# Altium project ArduinoNano.PrjPcb
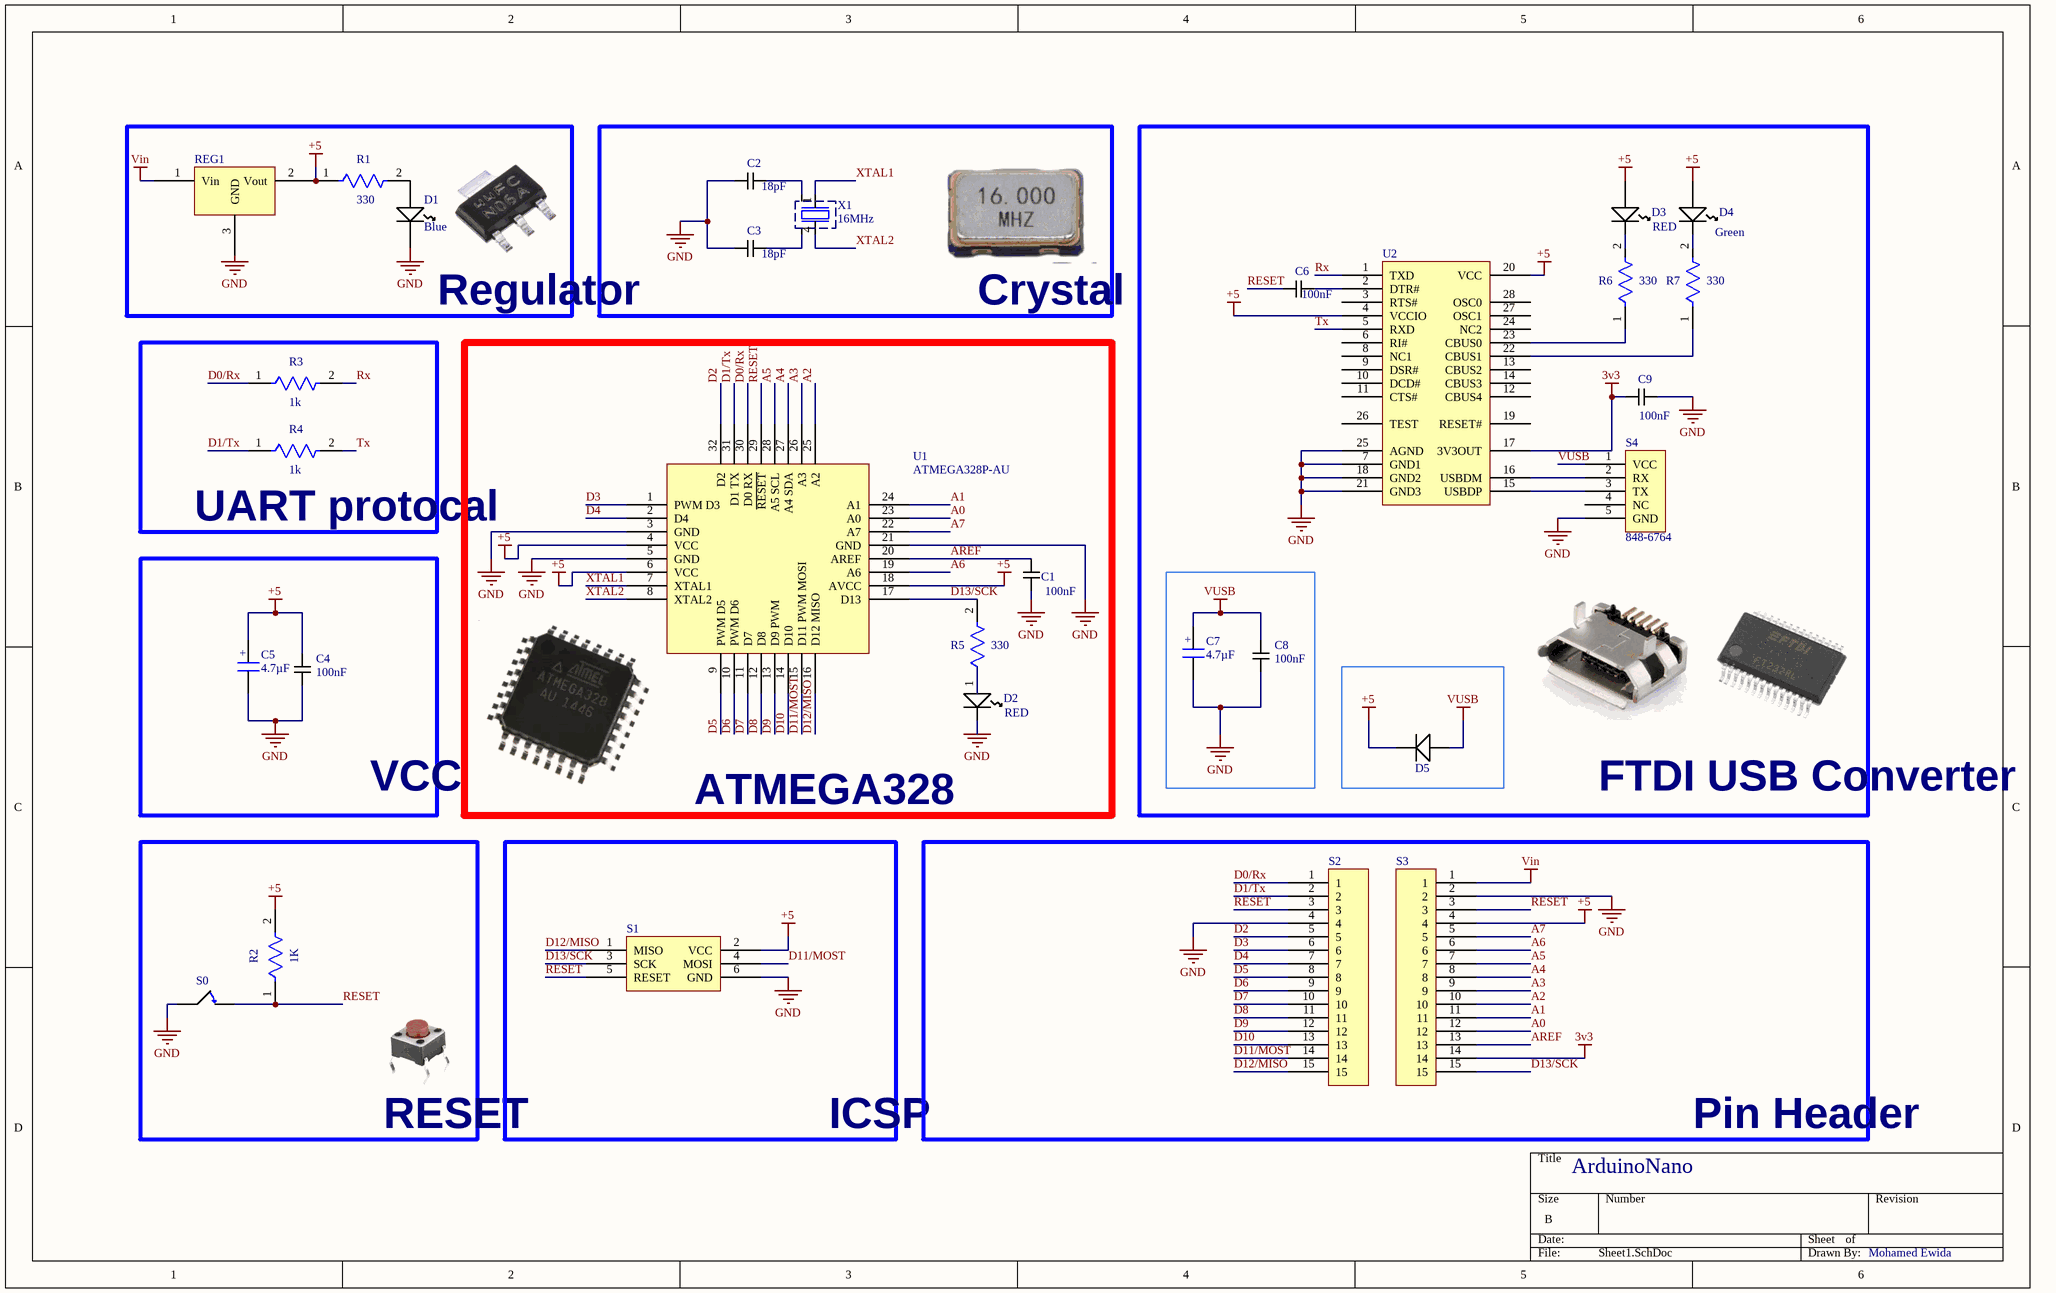
[diagram p0: Sheet1.SchDoc]
1 sheet, 30 parts. Net scope: global (net labels, ports and power ports of the same name join across sheets).
Board file: PCB1.PcbDoc

## Sheet Sheet1.SchDoc
size B; SheetNumber: 1; SheetTotal: 1

### Parts
C1  Capacitance: 100nF  [CAPCP2012X09N]  (hidden comment: 100nF Ceramic Multilayer Capacitor_1)
C2  Capacitance: 18pF  [CAPCP2012X09N]  (hidden comment: C0805C180J5GACTU)
C3  Capacitance: 18pF  [CAPCP2012X09N]  (hidden comment: C0805C180J5GACTU)
C4  Capacitance: 100nF  [CAPCP2012X09N]  (hidden comment: 100nF Ceramic Multilayer Capacitor_1)
C5  value 4.7µF  [CASE A - 3216X18]  (hidden comment: Capacitor SMT Tantalum)
C6  Capacitance: 100nF  [CAPCP2012X09N]  (hidden comment: 100nF Ceramic Multilayer Capacitor_1)
C7  value 4.7µF  [CASE A - 3216X18]  (hidden comment: Capacitor SMT Tantalum)
C8  Capacitance: 100nF  [CAPCP2012X09N]  (hidden comment: 100nF Ceramic Multilayer Capacitor_1)
C9  Capacitance: 100nF  [CAPCP2012X09N]  (hidden comment: 100nF Ceramic Multilayer Capacitor_1)
D1  Kingbright Blue LED, 60 mcd 120 ° 0805  [LED1913X12NBLUE]  (value not drawn)
D2  Color: RED  [LED1913X12NRED]  (hidden comment: Kingbright Red LED, 100 mcd 120 ° 0805)
D3  Color: RED  [LED1913X12NRED]  (hidden comment: Kingbright Red LED, 100 mcd 120 ° 0805)
D4  Color: Green  [LED1913X12NGREEN]  (hidden comment: Kingbright Green LED, 70 mcd 120 ° 0805)
D5  Panasonic DB2J20900L Schottky Diode, 0.5A, 20V, 2.4ns, 2-Pin SMini2 F5 B  [DIOM1712X07N]  (value not drawn)
R1  ERA-3AEB102V  [FP-ERA3A-IPC_C]  (value not drawn)
R2  ERA-3AEB102V  [FP-ERA3A-IPC_C]  (value not drawn)
R3  Resistance: 1k  [FP-ERA3A-IPC_C]  (hidden comment: ERA-3AEB102V)
R4  Resistance: 1k  [FP-ERA3A-IPC_C]  (hidden comment: ERA-3AEB102V)
R5  Resistance: 330  [FP-ERA3A-IPC_C]  (hidden comment: ERA-3AEB102V)
R6  Resistance: 330  [FP-ERA3A-IPC_C]  (hidden comment: ERA-3AEB102V)
R7  Resistance: 330  [FP-ERA3A-IPC_C]  (hidden comment: ERA-3AEB102V)
REG1  LM1117MP-5.0/NOPB, Low Dropout Voltage Regulator, 1.5A, 5 V ±1%, 4-Pin SOT-223  [SOT230P700X180-4N]  (value not drawn)
S0  Tactile Switch SPST- NO 0.05A @24V  [Tactile Switch]  (value not drawn)
S1  Programming Headers Dual Row  [ISP HEADER]  (value not drawn)
S2  connector;str header;single row;.1 cont centers;.095 tail;gold or gtx;36 contact  [Header]  (value not drawn)
S3  connector;str header;single row;.1 cont centers;.095 tail;gold or gtx;36 contact  [Header]  (value not drawn)
S4  RS Stock No: 848-6764  [MicroUSB]  (hidden comment: NewMolex Right Angle SMT Female Type B Micro USB Connector, 30 V ac, 1.8A)
U1  ATMEGA328P-AU  [TQFP80P900X900X120-32N]
U2  FT232RL, Universal Asynchronous Receiver & Transmitter 3MBd, 28-Pin, SSOP  [SOP65P780X200-28N]  (value not drawn)
X1  value 16MHz  [Aker S5C Crystal]  (hidden comment: Aker 16MHz Crystal SMT)

### Blocks framed on the sheet
Regulator: D1 R1 REG1
Crystal: C2 C3 X1
FTDI USB Converter: C6-C9 D3-D5 R6 R7 S4 U2
UART protocal: R3 R4
ATMEGA328: C1 D2 R5 U1
VCC: C4 C5
RESET: R2 S0
ICSP: S1
Pin Header: S2 S3

### Nets
3v3: C9.1 S3.14 U2.17(3V3OUT)
+5: C4.2 C5.1 D3.1(A) D4.1(A) D5.1 R1.1 R2.2 REG1.2(Vout) S1.2(VCC) S3.4 U1.4(VCC) U1.6(VCC) U1.18(AVCC) U2.4(VCCIO) U2.20(VCC)
GND: C1.1 C2.1 C3.1 C4.1 C5.2 C7.2 C8.1 C9.2 D1.2(K) D2.2(K) S0.1 S1.6(GND) S2.4 S3.2 S4.5(GND) U1.3(GND) U1.5(GND) U1.21(GND) U2.7(GND1) U2.18(GND2) U2.21(GND3) U2.25(AGND)
Vin: REG1.1(Vin) S3.1
VUSB: C7.1 C8.2 D5.2 S4.1(VCC)
A0: S3.12 U1.23(A0)
A1: S3.11 U1.24(A1)
A2: S3.10 U1.25(A2)
A3: S3.9 U1.26(A3)
A4: S3.8 U1.27(A4_SDA)
A5: S3.7 U1.28(A5_SCL)
A6: S3.6 U1.19(A6)
A7: S3.5 U1.22(A7)
AREF: C1.2 S3.13 U1.20(AREF)
D0/Rx: R3.1 S2.1 U1.30(D0_RX)
D1/Tx: R4.1 S2.2 U1.31(D1_TX)
D2: S2.5 U1.32(D2)
D3: S2.6 U1.1(PWM_D3)
D4: S2.7 U1.2(D4)
D5: S2.8 U1.9(PWM_D5)
D6: S2.9 U1.10(PWM_D6)
D7: S2.10 U1.11(D7)
D8: S2.11 U1.12(D8)
D9: S2.12 U1.13(D9_PWM)
D10: S2.13 U1.14(D10)
D11/MOST: S1.4(MOSI) S2.14 U1.15(D11_PWM_MOSI)
D12/MISO: S1.1(MISO) S2.15 U1.16(D12_MISO)
D13/SCK: R5.2 S1.3(SCK) S3.15 U1.17(D13)
RESET: C6.1 R2.1 S0.1 S1.5(RESET) S2.3 S3.3 U1.29(~{RESET})
Rx: R3.2 U2.1(TXD)
Tx: R4.2 U2.5(RXD)
XTAL1: U1.7(XTAL1) X1.1
XTAL2: U1.8(XTAL2) X1.4
NetC2_2: C2.2 X1.3(Gnd)
NetC3_2: C3.2 X1.2(Gnd)
NetC6_2: C6.2 U2.2(DTR#)
NetD1_1: D1.1(A) R1.2
NetD2_1: D2.1(A) R5.1
NetD3_2: D3.2(K) R6.2
NetD4_2: D4.2(K) R7.2
NetR6_1: R6.1 U2.23(CBUS0)
NetR7_1: R7.1 U2.22(CBUS1)
NetS4_2: S4.2(RX) U2.16(USBDM)
NetS4_3: S4.3(TX) U2.15(USBDP)

Not connected (* = marked no-connect by the designer): REG1 3(GND); S4 4(NC); U2 3(RTS#) 6(RI#) 8(NC1) 9(DSR#) 10(DCD#) 11(CTS#) 12(CBUS4) 13(CBUS2) 14(CBUS3) 19(RESET#) 24(NC2) 26(TEST) 27(OSC1) 28(OSC0)

### Notes on the sheet
- (near R1) 330
- (near D1) Blue
- (near R2) 1K
- ArduinoNano
- Mohamed Ewida
- Labels drawn without touching a wire or pin: GND
- (in symbol 4.7µF Tant RS 496-3545) +

### Library data of the parts
C1 C4 C6 C8 C9 = 100nF Ceramic Multilayer Capacitor_1: AVX 0805 Standard 100nF Ceramic Multilayer Capacitor, 50 V dc X7R Dielectric ±10% SMD; Voltage: 50V; Creator: Ritesh Kanjee; Date Created: 18 February 2015; Package: 0805; Manufacturer: AVX; RS Stock No.: 464-6688; Datasheet URL: http://za.rs-online.com/web/p/ceramic-multilayer-capacitors/4646688/
C2 C3 = 18pF Ceramic Multilayer Capacitor, 50 V dc C0G Dielectric ±5% SMD: Manufacturer: Kemet; Voltage: 50V; Creator: Ritesh Kanjee; Date Created: 18 February 2015; Package: 0805; RS Stock No.: 648-0935; Datasheet URL: http://za.rs-online.com/web/p/ceramic-multilayer-capacitors/6480935/?searchTerm=C0805C180J5GACTU&relevancy-data=636F3D3226696E3D4931384E4B6E6F776E41734D504E266C753D656E266D6D3D6D61746368616C6C7061727469616C26706D3D5E5B5C707B4C7D5C707B4E647D2D2C2F255C2E5D2B2426706F3D313326736E3D592673743D4D414E5F504152545F4E554D4245522677633D424F5448267573743D4330383035433138304A35474143545526
C5 C7 = 4.7µF Tant RS 496-3545: Capacitor,tantalum,SMT,16V,4.7uF,10%,A-case; Part Originator: H Theron; RS Stock Nr.: 496-3545; Tolerance: 10%; Package: 3216-18; Publisher: DPSS; LatestRevisionDate: 28-April-2010; ComponentLink1Description: Supplier Website; ComponentLink1URL: http://za.rs-online.com/web/search/searchBrowseAction.html?method=getProduct&R=4963545; ComponentLink2Description: RS Data sheet; ComponentLink2URL: http://docs-europe.origin.electrocomponents.com/webdocs/04ed/0900766b804ed4cc.pdf; Voltage: 16V
D1 = Kingbright Blue LED, 60 mcd 120 ° 0805: Manufacturer Part No.: KP-2012PBC-A; Forward Voltage: 3.2V; Creator: Ritesh Kanjee; Date Created: 18 February 2015; Manufacturer: KingBright; RS Stock No.: 466-3784; Datasheet URL: http://za.rs-online.com/web/p/visible-leds/4663784/; Color: Blue
D2 D3 = Kingbright Red LED, 100 mcd 120 ° 0805: Manufacturer Part No.: KP-2012SRC-PRV; Forward Voltage: 1.85V; Creator: Ritesh Kanjee; Date Created: 18 February 2015; Manufacturer: KingBright; RS Stock No.: 466-3813; Datasheet URL: http://za.rs-online.com/web/p/visible-leds/4663813/
D4 = Kingbright Green LED, 70 mcd 120 ° 0805: Manufacturer Part No.: KP-2012MGC; Forward Voltage: 2.1 V; Creator: Ritesh Kanjee; Date Created: 18 February 2015; Manufacturer: KingBright; RS Stock No.: 466-3778; Datasheet URL: http://za.rs-online.com/web/p/visible-leds/4663778/
D5 = Schottky Diode, 0.5A, 20V, 2.4ns, 2-Pin SMini2 F5 B: Created By: R Kanjee; Date Created: 1 March 2015; Manufacturer: Panasonic; RS Stock No.: 713-2703; Manufacturer Part No.: DB2J20900L; Datasheet: http://docs-europe.electrocomponents.com/webdocs/1398/0900766b813986b3.pdf; Maximum Continuous Forward Current: 0.5A; Peak Reverse Repetitive Voltage: 20V
R1 R2 = CMP-2000-00873-2: RES SMD 1K OHM 0.1% 1/10W 0603; Temperature Coefficient: 25ppm/°C; Voltage Rating: 75V; Max Power Dissipation: 100mW; Resistance: 1kR; Technology: METAL FILM; Number of Pins: 2; Packaging: Tape and Reel; Case Code (Imperial): 0603; Case Code (Metric): 1608; Min Operating Temperature: -55°C; REACH SVHC: No SVHC; Length: 1.6mm; Termination: SMD/SMT; Depth: 0.8mm; Resistance Tolerance: 0.1%; Number of Terminations: 2; Width: 0.8mm; Military Standard: Not; Tolerance: 0.1%; Package Quantity: 5000; Contact Plating: Tin; Height: 0.45mm; Construction: Rectangular; Case/Package: 0603; Max Operating Temperature: 155°C; Resistor Type: Thin Film; Series: ERA-3A; Size Code: 0603; RoHS Compliant: Yes; Mount: Surface Mount; Radiation Hardening: No; Power Rating: 100mW
R3-R7 = CMP-2000-00873-2: RES SMD 1K OHM 0.1% 1/10W 0603; Temperature Coefficient: 25ppm/°C; Voltage Rating: 75V; Max Power Dissipation: 100mW; Technology: METAL FILM; Number of Pins: 2; Packaging: Tape and Reel; Case Code (Imperial): 0603; Case Code (Metric): 1608; Min Operating Temperature: -55°C; REACH SVHC: No SVHC; Length: 1.6mm; Termination: SMD/SMT; Depth: 0.8mm; Resistance Tolerance: 0.1%; Number of Terminations: 2; Width: 0.8mm; Military Standard: Not; Tolerance: 0.1%; Package Quantity: 5000; Contact Plating: Tin; Height: 0.45mm; Construction: Rectangular; Case/Package: 0603; Max Operating Temperature: 155°C; Resistor Type: Thin Film; Series: ERA-3A; Size Code: 0603; RoHS Compliant: Yes; Mount: Surface Mount; Radiation Hardening: No; Power Rating: 100mW
REG1 = LM1117MP-5.0: Manufacturer: Texas Instruments; Supply Current: 1.5Amps; Output Voltage: 5V; Maximum Input Voltage: 15V; Date Created: 26 February 2015; Created By: R Kanjee; RS Stock No.: 533-9583; Datasheet URL: http://za.rs-online.com/web/p/low-dropout-voltage-regulators/5339583/
S0 = Tactile Switch SPST- NO 0.05A @24V: Manufacturer: Omron; Manufacturer Part No.: B3F1000; State: Normaly Open; Date Created: 25 February 2015; Creator: R Kanjee; RS Stock No.: 686-6847
S1 = Programming ISP, Programming Headers Dual Row: Manufacturer: FCI; Manufacturer Part No.: 68000-236HLF; Current Rating: 3Amps Continuous; Created By: R Kanjee; Date Created: 1 March 2015; RS Stock No.: 2509565626
S2 S3 = Single row; PCB headers: Manufacturer: FCI; Manufacturer Part No.: 68000-236HLF; Current Rating: 3Amps Continuous; Created By: R Kanjee; Date Created: 1 March 2015; RS Stock No.: 2509565626
S4 = Micro USB Connector, 30 V ac, 1.8A: Manufacturer: Molex; Manufacturer Part No.: 105017-0001; Max Voltage: 30V; Creator: R Kanjee; Date Created: 28 February 2015; Datasheet URL: http://za.rs-online.com/web/p/micro-usb-connectors/8486764/; Max Current: 1.8A
U1 = ATMEGA328P-AU: ATMEGA328P-AU, 8 bit AVR Microcontroller 20MHz 1 kB, 32 kB Flash, 2 kB RAM, I2C 32-Pin TQFP; Company: Lumina Inova; Created By: Ritesh Kanjee; Date Created: 14 February 2015; RS Stock No.: 696-3092; Datasheet URL: http://docs-europe.electrocomponents.com/webdocs/0db4/0900766b80db4deb.pdf
U2 = FT232RL USB to UART, Universal Asynchronous Receiver & Transmitter 3MBd, 28-Pin, SSOP: Manufacturer: FTDI Chip; Creator: R Kanjee; Date Created: 03 March 2015; Manufacturer Part No.: FT232RL; RS Stock No.: 406-580; Pin Count: 28
X1 = Aker  C5S-16.000-12-3030-X: Aker S5C SMT Crystal; Load Capacitance: 12pF; Frequency Stability: +/-30ppm; RS: RS 671-9488; Creator: R Kanjee; Manufacturer: Aker; Manufacturer Part #: C5S-16.000-12-3030-X; Supplier: RS; RS Stock Nr.: 671-9488; HelpURL: http://za.rs-online.com/web/p/crystal-units/6719488/; Package: 3.2x5mm SMD